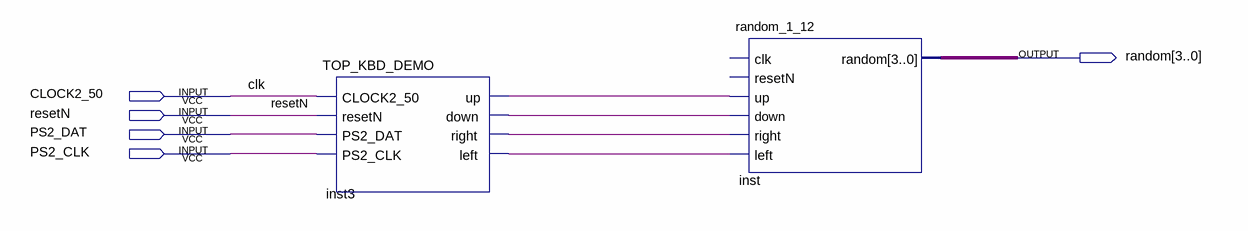
[diagram p0: schematic sheet]
// Quartus schematic random_1_12_top.bdf as structural Verilog: 2 symbols, 5 pins
module random_1_12_top (
  input  CLOCK2_50,
  input  resetN,
  input  PS2_DAT,
  input  PS2_CLK,
  output [3:0] random
);

  wire inst3_down, inst3_left, inst3_right, inst3_up;

  TOP_KBD_DEMO inst3 (
    .CLOCK2_50(CLOCK2_50), .resetN(resetN), .PS2_DAT(PS2_DAT), .PS2_CLK(PS2_CLK), .up(inst3_up),
    .down(inst3_down), .right(inst3_right), .left(inst3_left));
  random_1_12 inst (
    .up(inst3_up), .down(inst3_down), .right(inst3_right), .left(inst3_left), .random(random));  // open: clk, resetN

  // Other names for the same wires on the sheet: clk = CLOCK2_50
endmodule
